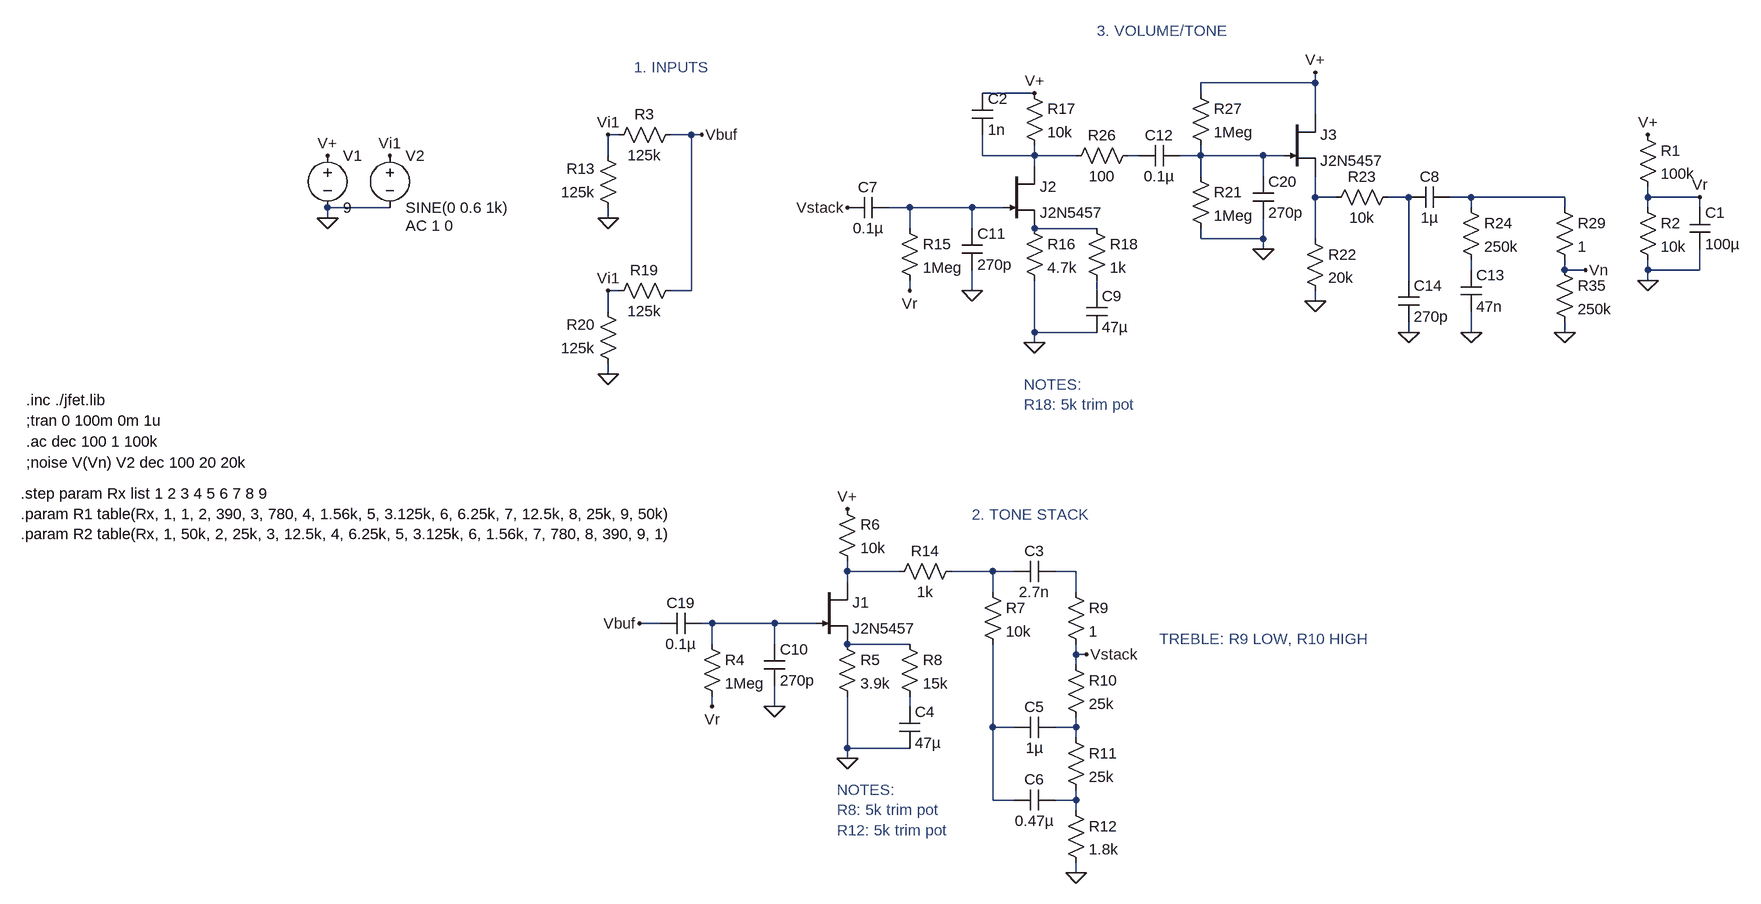
[diagram p0: schematic JFET_B.asc]
JFET_B.asc, the LTspice schematic file:
Version 4
SHEET 1 3108 1620
WIRE 2240 -32 2240 -48
WIRE 2240 -32 2064 -32
WIRE 1808 -16 1728 -16
WIRE 2064 -16 2064 -32
WIRE 2240 16 2240 -32
WIRE 1168 48 1152 48
WIRE 1280 48 1248 48
WIRE 1296 48 1280 48
WIRE 1152 80 1152 48
WIRE 1728 80 1728 48
WIRE 1808 80 1808 64
WIRE 1808 80 1728 80
WIRE 1872 80 1808 80
WIRE 1968 80 1952 80
WIRE 2064 80 2064 64
WIRE 2064 80 2032 80
WIRE 2160 80 2064 80
WIRE 2192 80 2160 80
WIRE 1808 96 1808 80
WIRE 2064 112 2064 80
WIRE 2160 112 2160 80
WIRE 2240 144 2240 112
WIRE 2272 144 2240 144
WIRE 2384 144 2352 144
WIRE 2480 144 2448 144
WIRE 2624 144 2480 144
WIRE 2752 144 2752 128
WIRE 2832 144 2752 144
WIRE 816 160 720 160
WIRE 1616 160 1584 160
WIRE 1712 160 1616 160
WIRE 1760 160 1712 160
WIRE 2480 160 2480 144
WIRE 2624 160 2624 144
WIRE 2752 160 2752 144
WIRE 2832 160 2832 144
WIRE 720 176 720 160
WIRE 1152 176 1152 160
WIRE 1616 192 1616 160
WIRE 1712 192 1712 160
WIRE 1904 192 1808 192
WIRE 2064 208 2064 192
WIRE 2160 208 2160 176
WIRE 2160 208 2064 208
WIRE 2240 208 2240 144
WIRE 2160 224 2160 208
WIRE 2480 256 2480 240
WIRE 2624 256 2624 240
WIRE 2656 256 2624 256
WIRE 2752 256 2752 240
WIRE 2832 256 2832 224
WIRE 2832 256 2752 256
WIRE 2384 272 2384 144
WIRE 2752 272 2752 256
WIRE 1168 288 1152 288
WIRE 1280 288 1280 48
WIRE 1280 288 1248 288
WIRE 1616 288 1616 272
WIRE 1712 288 1712 256
WIRE 1904 288 1904 272
WIRE 2240 304 2240 288
WIRE 1152 320 1152 288
WIRE 1808 352 1808 272
WIRE 1904 352 1808 352
WIRE 2384 352 2384 336
WIRE 2480 352 2480 320
WIRE 2624 352 2624 336
WIRE 1808 368 1808 352
WIRE 1152 416 1152 400
WIRE 1520 720 1520 704
WIRE 1600 720 1520 720
WIRE 1744 720 1680 720
WIRE 1776 720 1744 720
WIRE 1872 720 1840 720
WIRE 1520 736 1520 720
WIRE 1744 752 1744 720
WIRE 1872 752 1872 720
WIRE 1232 800 1200 800
WIRE 1312 800 1296 800
WIRE 1408 800 1312 800
WIRE 1472 800 1408 800
WIRE 1312 832 1312 800
WIRE 1408 832 1408 800
WIRE 1616 832 1520 832
WIRE 1872 848 1872 832
WIRE 1888 848 1872 848
WIRE 1872 864 1872 848
WIRE 1312 928 1312 912
WIRE 1408 928 1408 896
WIRE 1616 928 1616 912
WIRE 1744 960 1744 832
WIRE 1776 960 1744 960
WIRE 1872 960 1872 944
WIRE 1872 960 1840 960
WIRE 1872 976 1872 960
WIRE 1520 992 1520 912
WIRE 1616 992 1520 992
WIRE 1520 1008 1520 992
WIRE 1744 1072 1744 960
WIRE 1776 1072 1744 1072
WIRE 1872 1072 1872 1056
WIRE 1872 1072 1840 1072
WIRE 1872 1088 1872 1072
WIRE 1872 1184 1872 1168
FLAG 720 176 0
FLAG 720 80 V+
FLAG 816 80 Vi1
FLAG 2752 272 0
FLAG 2752 48 V+
FLAG 2832 144 Vr
FLAG 1312 928 Vr
FLAG 1520 624 V+
FLAG 1520 1008 0
FLAG 1872 1184 0
FLAG 1616 288 Vr
FLAG 1808 -16 V+
FLAG 1808 368 0
FLAG 1712 288 0
FLAG 2240 -48 V+
FLAG 2480 352 0
FLAG 1408 928 0
FLAG 2160 224 0
FLAG 1296 48 Vbuf
FLAG 1200 800 Vbuf
FLAG 1888 848 Vstack
FLAG 2240 304 0
FLAG 1520 160 Vstack
FLAG 2624 352 0
FLAG 1152 176 0
FLAG 1152 416 0
FLAG 2656 256 Vn
FLAG 1152 48 Vi1
FLAG 1152 288 Vi1
FLAG 2384 352 0
SYMBOL voltage 720 64 R0
SYMATTR InstName V1
SYMATTR Value 9
SYMBOL voltage 816 64 R0
WINDOW 123 24 124 Left 2
WINDOW 39 0 0 Left 2
SYMATTR Value2 AC 1 0
SYMATTR InstName V2
SYMATTR Value SINE(0 0.6 1k)
SYMBOL res 2736 32 R0
SYMATTR InstName R1
SYMATTR Value 100k
SYMBOL res 2736 144 R0
SYMATTR InstName R2
SYMATTR Value 10k
SYMBOL cap 2816 160 R0
SYMATTR InstName C1
SYMATTR Value 100µ
SYMATTR SpiceLine V=6.3 Rser=0.9
SYMBOL res 1296 816 R0
SYMATTR InstName R4
SYMATTR Value 1Meg
SYMBOL njf 1472 736 R0
SYMATTR InstName J1
SYMATTR Value J2N5457
SYMBOL res 1504 816 R0
SYMATTR InstName R5
SYMATTR Value 3.9k
SYMBOL res 1504 608 R0
SYMATTR InstName R6
SYMATTR Value 10k
SYMBOL cap 1600 928 R0
SYMATTR InstName C4
SYMATTR Value 47µ
SYMBOL res 1600 816 R0
SYMATTR InstName R8
SYMATTR Value 15k
SYMBOL res 1728 736 R0
SYMATTR InstName R7
SYMATTR Value 10k
SYMBOL res 1856 736 R0
SYMATTR InstName R9
SYMATTR Value 1
SYMBOL res 1856 848 R0
SYMATTR InstName R10
SYMATTR Value 25k
SYMBOL res 1856 960 R0
SYMATTR InstName R11
SYMATTR Value 25k
SYMBOL res 1856 1072 R0
SYMATTR InstName R12
SYMATTR Value 1.8k
SYMBOL cap 1840 704 R90
WINDOW 0 0 32 VBottom 2
WINDOW 3 32 32 VTop 2
SYMATTR InstName C3
SYMATTR Value 2.7n
SYMBOL cap 1840 944 R90
WINDOW 0 0 32 VBottom 2
WINDOW 3 32 32 VTop 2
SYMATTR InstName C5
SYMATTR Value 1µ
SYMBOL cap 1840 1056 R90
WINDOW 0 0 32 VBottom 2
WINDOW 3 32 32 VTop 2
SYMATTR InstName C6
SYMATTR Value 0.47µ
SYMBOL cap 1584 144 R90
WINDOW 0 0 32 VBottom 2
WINDOW 3 32 32 VTop 2
SYMATTR InstName C7
SYMATTR Value 0.1µ
SYMBOL res 1600 176 R0
SYMATTR InstName R15
SYMATTR Value 1Meg
SYMBOL njf 1760 96 R0
SYMATTR InstName J2
SYMATTR Value J2N5457
SYMBOL res 1792 176 R0
SYMATTR InstName R16
SYMATTR Value 4.7k
SYMBOL res 1792 -32 R0
SYMATTR InstName R17
SYMATTR Value 10k
SYMBOL cap 1888 288 R0
SYMATTR InstName C9
SYMATTR Value 47µ
SYMBOL res 1888 176 R0
SYMATTR InstName R18
SYMATTR Value 1k
SYMBOL cap 2448 128 R90
WINDOW 0 0 32 VBottom 2
WINDOW 3 32 32 VTop 2
SYMATTR InstName C8
SYMATTR Value 1µ
SYMBOL cap 1696 192 R0
SYMATTR InstName C11
SYMATTR Value 270p
SYMBOL njf 2192 16 R0
SYMATTR InstName J3
SYMATTR Value J2N5457
SYMBOL cap 2032 64 R90
WINDOW 0 0 32 VBottom 2
WINDOW 3 32 32 VTop 2
SYMATTR InstName C12
SYMATTR Value 0.1µ
SYMBOL res 2048 96 R0
SYMATTR InstName R21
SYMATTR Value 1Meg
SYMBOL res 2224 192 R0
SYMATTR InstName R22
SYMATTR Value 20k
SYMBOL res 2368 128 R90
WINDOW 0 0 56 VBottom 2
WINDOW 3 32 56 VTop 2
SYMATTR InstName R23
SYMATTR Value 10k
SYMBOL res 2464 144 R0
SYMATTR InstName R24
SYMATTR Value 250k
SYMBOL cap 2464 256 R0
SYMATTR InstName C13
SYMATTR Value 47n
SYMBOL cap 1296 784 R90
WINDOW 0 0 32 VBottom 2
WINDOW 3 32 32 VTop 2
SYMATTR InstName C19
SYMATTR Value 0.1µ
SYMBOL cap 1392 832 R0
SYMATTR InstName C10
SYMATTR Value 270p
SYMBOL cap 2144 112 R0
SYMATTR InstName C20
SYMATTR Value 270p
SYMBOL res 2608 144 R0
SYMATTR InstName R29
SYMATTR Value 1
SYMBOL res 2608 240 R0
SYMATTR InstName R35
SYMATTR Value 250k
SYMBOL res 1264 32 R90
WINDOW 0 0 56 VBottom 2
WINDOW 3 32 56 VTop 2
SYMATTR InstName R3
SYMATTR Value 125k
SYMBOL res 1168 176 R180
WINDOW 0 36 76 Left 2
WINDOW 3 36 40 Left 2
SYMATTR InstName R13
SYMATTR Value 125k
SYMBOL res 1152 304 R270
WINDOW 0 32 56 VTop 2
WINDOW 3 0 56 VBottom 2
SYMATTR InstName R19
SYMATTR Value 125k
SYMBOL res 1168 416 R180
WINDOW 0 36 76 Left 2
WINDOW 3 36 40 Left 2
SYMATTR InstName R20
SYMATTR Value 125k
SYMBOL res 1968 64 R90
WINDOW 0 0 56 VBottom 2
WINDOW 3 32 56 VTop 2
SYMATTR InstName R26
SYMATTR Value 100
SYMBOL res 2048 -32 R0
SYMATTR InstName R27
SYMATTR Value 1Meg
SYMBOL res 1696 704 R90
WINDOW 0 0 56 VBottom 2
WINDOW 3 32 56 VTop 2
SYMATTR InstName R14
SYMATTR Value 1k
SYMBOL cap 1712 -16 R0
SYMATTR InstName C2
SYMATTR Value 1n
SYMBOL cap 2368 272 R0
SYMATTR InstName C14
SYMATTR Value 270p
TEXT 256 456 Left 2 !.inc ./jfet.lib
TEXT 256 488 Left 2 !;tran 0 100m 0m 1u
TEXT 256 520 Left 2 !.ac dec 100 1 100k
TEXT 248 600 Left 2 !.step param Rx list 1 2 3 4 5 6 7 8 9\n.param R1 table(Rx, 1, 1, 2, 390, 3, 780, 4, 1.56k, 5, 3.125k, 6, 6.25k, 7, 12.5k, 8, 25k, 9, 50k)\n.param R2 table(Rx, 1, 50k, 2, 25k, 3, 12.5k, 4, 6.25k, 5, 3.125k, 6, 1.56k, 7, 780, 8, 390, 9, 1)
TEXT 256 552 Left 2 !;noise V(Vn) V2 dec 100 20 20k
TEXT 1792 432 Left 2 ;NOTES:\nR18: 5k trim pot
TEXT 1504 1056 Left 2 ;NOTES:\nR8: 5k trim pot\nR12: 5k trim pot
TEXT 1192 -56 Left 2 ;1. INPUTS
TEXT 1712 632 Left 2 ;2. TONE STACK
TEXT 1904 -112 Left 2 ;3. VOLUME/TONE
TEXT 2000 824 Left 2 ;TREBLE: R9 LOW, R10 HIGH

The netlist it stands for:
* JFET_B.asc
V1 V+ 0 9
V2 Vi1 0 SINE(0 0.6 1k) AC 1 0
R1 V+ Vr 100k
R2 Vr 0 10k
C1 Vr 0 100µ V=6.3 Rser=0.9
R4 N014 Vr 1Meg
J1 N011 N014 N015 J2N5457
R5 N015 0 3.9k
R6 V+ N011 10k
C4 N016 0 47µ
R8 N015 N016 15k
R7 N012 N017 10k
R9 N013 Vstack 1
R10 Vstack N018 25k
R11 N018 N019 25k
R12 N019 0 1.8k
C3 N013 N012 2.7n
C5 N018 N017 1µ
C6 N019 N017 0.47µ
C7 N007 Vstack 0.1µ
R15 N007 Vr 1Meg
J2 N001 N007 N008 J2N5457
R16 N008 0 4.7k
R17 V+ N001 10k
C9 N010 0 47µ
R18 N008 N010 1k
C8 N006 N005 1µ
C11 N007 0 270p
J3 V+ N003 N004 J2N5457
C12 N003 N002 0.1µ
R21 N003 0 1Meg
R22 N004 0 20k
R23 N005 N004 10k
R24 N006 N009 250k
C13 N009 0 47n
C19 N014 Vbuf 0.1µ
C10 N014 0 270p
C20 N003 0 270p
R29 N006 Vn 1
R35 Vn 0 250k
R3 Vbuf Vi1 125k
R13 0 Vi1 125k
R19 Vi1 Vbuf 125k
R20 0 Vi1 125k
R26 N002 N001 100
R27 V+ N003 1Meg
R14 N012 N011 1k
C2 V+ N001 1n
C14 N005 0 270p
.model NJF NJF
.model PJF PJF
.lib standard.jft
.inc ./jfet.lib
;tran 0 100m 0m 1u
.ac dec 100 1 100k
.step param Rx list 1 2 3 4 5 6 7 8 9
.param R1 table(Rx, 1, 1, 2, 390, 3, 780, 4, 1.56k, 5, 3.125k, 6, 6.25k, 7, 12.5k, 8, 25k, 9, 50k)
.param R2 table(Rx, 1, 50k, 2, 25k, 3, 12.5k, 4, 6.25k, 5, 3.125k, 6, 1.56k, 7, 780, 8, 390, 9, 1)
;noise V(Vn) V2 dec 100 20 20k
* NOTES:
* R18: 5k trim pot
* NOTES:
* R8: 5k trim pot
* R12: 5k trim pot
* 1. INPUTS
* 2. TONE STACK
* 3. VOLUME/TONE
* TREBLE: R9 LOW, R10 HIGH
.backanno
.end